# EAGLE design SineWaveGen (EAGLE 6.5.0)
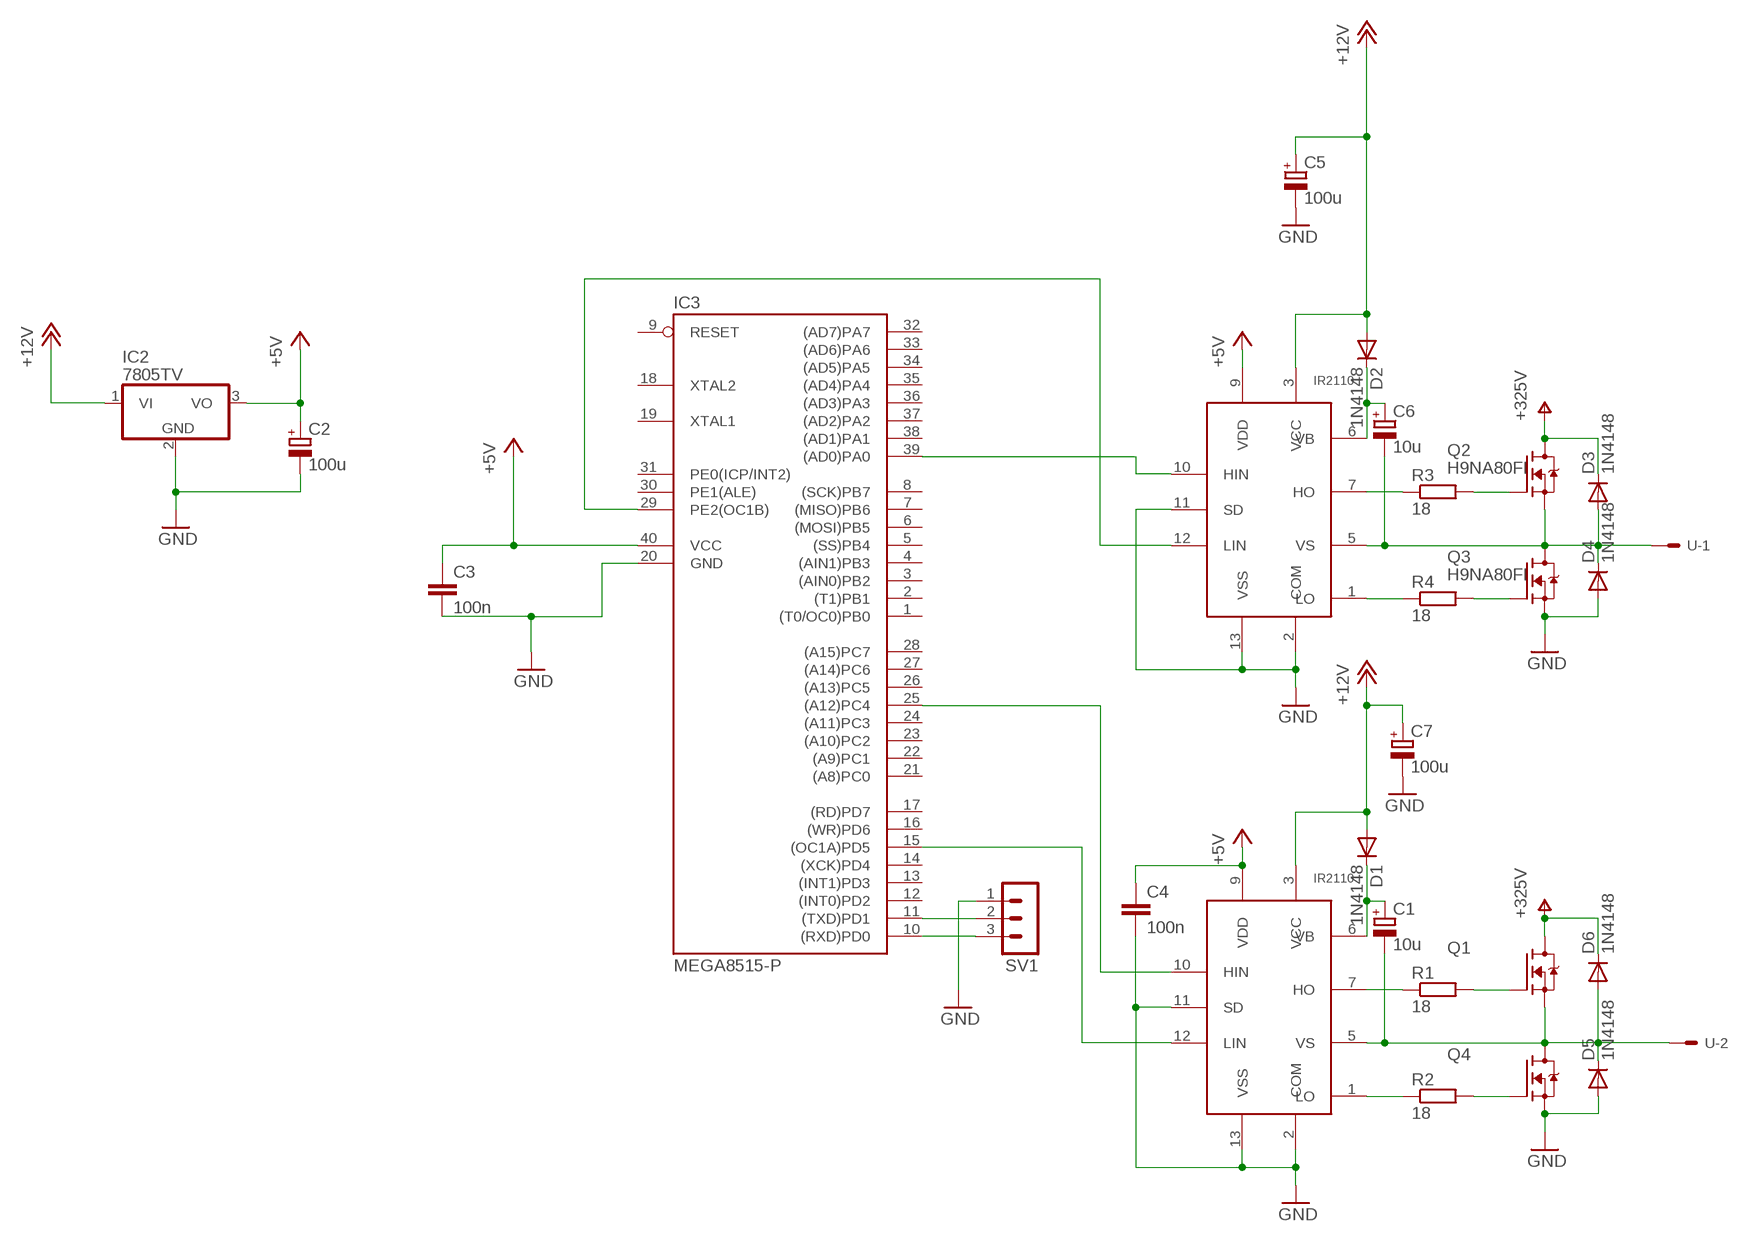
[diagram p0: schematic, sheet 1]

## Parts
C1  10u  CPOL-EUE2.5-7  [E2,5-7]
C2  100u  CPOL-EUE2.5-7  [E2,5-7]
C3  100n  C-EU050-035X075  [C050-035X075]
C4  100n  C-EU050-035X075  [C050-035X075]
C5  100u  CPOL-EUE2.5-7  [E2,5-7]
C6  10u  CPOL-EUE2.5-7  [E2,5-7]
C7  100u  CPOL-EUE2.5-7  [E2,5-7]
D1  1N4148  1N4148DO35-7  [DO35-7]
D2  1N4148  1N4148DO35-7  [DO35-7]
D3  1N4148  1N4148DO35-7  [DO35-7]
D4  1N4148  1N4148DO35-7  [DO35-7]
D5  1N4148  1N4148DO35-7  [DO35-7]
D6  1N4148  1N4148DO35-7  [DO35-7]
IC2  7805TV  [TO220V]
IC3  MEGA8515-P  [DIL40]
Q1  SPW47N60S5  [P-TO247]
Q2  H9NA80FI  SPW47N60S5  [P-TO247]
Q3  H9NA80FI  SPW47N60S5  [P-TO247]
Q4  SPW47N60S5  [P-TO247]
R1  18  R-EU_0207/12  [0207/12]
R2  18  R-EU_0207/12  [0207/12]
R3  18  R-EU_0207/12  [0207/12]
R4  18  R-EU_0207/12  [0207/12]
SV1  MA03-1  [MA03-1]
U  5566-2  [5566-2]
U$1  IR2110  IR2110DIL14  [DIL14]
U$2  IR2110  IR2110DIL14  [DIL14]

## Nets
+5V: C2.+ C3.1 C4.1 IC2.3(VO) IC3.40(VCC) U$1.9(VDD) U$2.9(VDD)
+12V: C5.+ C7.+ D1.A D2.A IC2.1(VI) U$1.3(VCC) U$2.3(VCC)
GND: C2.- C3.2 C4.2 C5.- C7.- D4.A D5.A IC2.2(GND) IC3.20(GND) Q3.3(S) Q4.3(S) SV1.1 U$1.2(COM) U$1.11(SD) U$1.13(VSS) U$2.2(COM) U$2.11(SD) U$2.13(VSS)
N$1: Q1.1(G) R1.2
N$2: IC3.39((AD0)PA0) U$2.10(HIN)
N$3: IC3.15((OC1A)PD5) U$1.12(LIN)
N$4: IC3.25((A12)PC4) U$1.10(HIN)
N$5: R2.1 U$1.1(LO)
N$6: C1.- D5.C D6.A Q1.3(S) Q4.2(D) U$1.5(VS) U.2
N$7: C1.+ D1.C U$1.6(VB)
N$8: Q4.1(G) R2.2
N$9: R1.1 U$1.7(HO)
N$10: IC3.11((TXD)PD1) SV1.2
N$11: IC3.10((RXD)PD0) SV1.3
N$12: IC3.29(PE2(OC1B)) U$2.12(LIN)
N$28: R3.1 U$2.7(HO)
N$29: Q2.1(G) R3.2
N$30: R4.1 U$2.1(LO)
N$31: Q3.1(G) R4.2
N$32: C6.- D3.A D4.C Q2.3(S) Q3.2(D) U$2.5(VS) U.1
N$35: C6.+ D2.C U$2.6(VB)
V+: D3.C D6.C Q1.2(D) Q2.2(D) ; supply symbol labelled +325V
Unconnected: IC3.1((T0/OC0)PB0) IC3.2((T1)PB1) IC3.3((AIN0)PB2) IC3.4((AIN1)PB3) IC3.5((SS)PB4) IC3.6((MOSI)PB5) IC3.7((MISO)PB6) IC3.8((SCK)PB7) IC3.9(RESET) IC3.12((INT0)PD2) IC3.13((INT1)PD3) IC3.14((XCK)PD4) IC3.16((WR)PD6) IC3.17((RD)PD7) IC3.18(XTAL2) IC3.19(XTAL1) IC3.21((A8)PC0) IC3.22((A9)PC1) IC3.23((A10)PC2) IC3.24((A11)PC3) IC3.26((A13)PC5) IC3.27((A14)PC6) IC3.28((A15)PC7) IC3.30(PE1(ALE)) IC3.31(PE0(ICP/INT2)) IC3.32((AD7)PA7) IC3.33((AD6)PA6) IC3.34((AD5)PA5) IC3.35((AD4)PA4) IC3.36((AD3)PA3) IC3.37((AD2)PA2) IC3.38((AD1)PA1)

## Library data of the parts
C1 C2 C5-C7 = rcl:CPOL-EU: POLARIZED CAPACITOR, European symbol
C3 C4 = rcl:C-EU: CAPACITOR, European symbol
D1-D6 = diode:1N4148: DIODE high speed (Philips)
IC2 = linear:78*: Positive VOLTAGE REGULATOR Source: http://cache.national.com/ds/LM/LM78L05.pdf http://www.fairchildsemi.com/ds/LM/LM7805.pdf
IC3 = atmel:MEGA8515-P: MICROCONTROLLER 8 Kbytes FLASH 512 bytes SRAM 512 bytes EEPROM USART 8-channel 10 bit ADC Source: avr.lbr; MPN: ATMEGA8515-16PU; OC_FARNELL: 9171401; OC_NEWARK: 01M6905
Q1-Q4 = transistor-fet:SPW47N60S5: Cool MOS Power Transistor
R1-R4 = rcl:R-EU_: RESISTOR, European symbol
SV1 = con-lstb:MA03-1: PIN HEADER; OC_FARNELL: unknown; OC_NEWARK: unknown
U = con-molex:5566-2: Mini FIT connector 2 pol Source: http://www.molex.com
U$1 U$2 = BLDC:IR2110: Halfbridge Driver

## Board
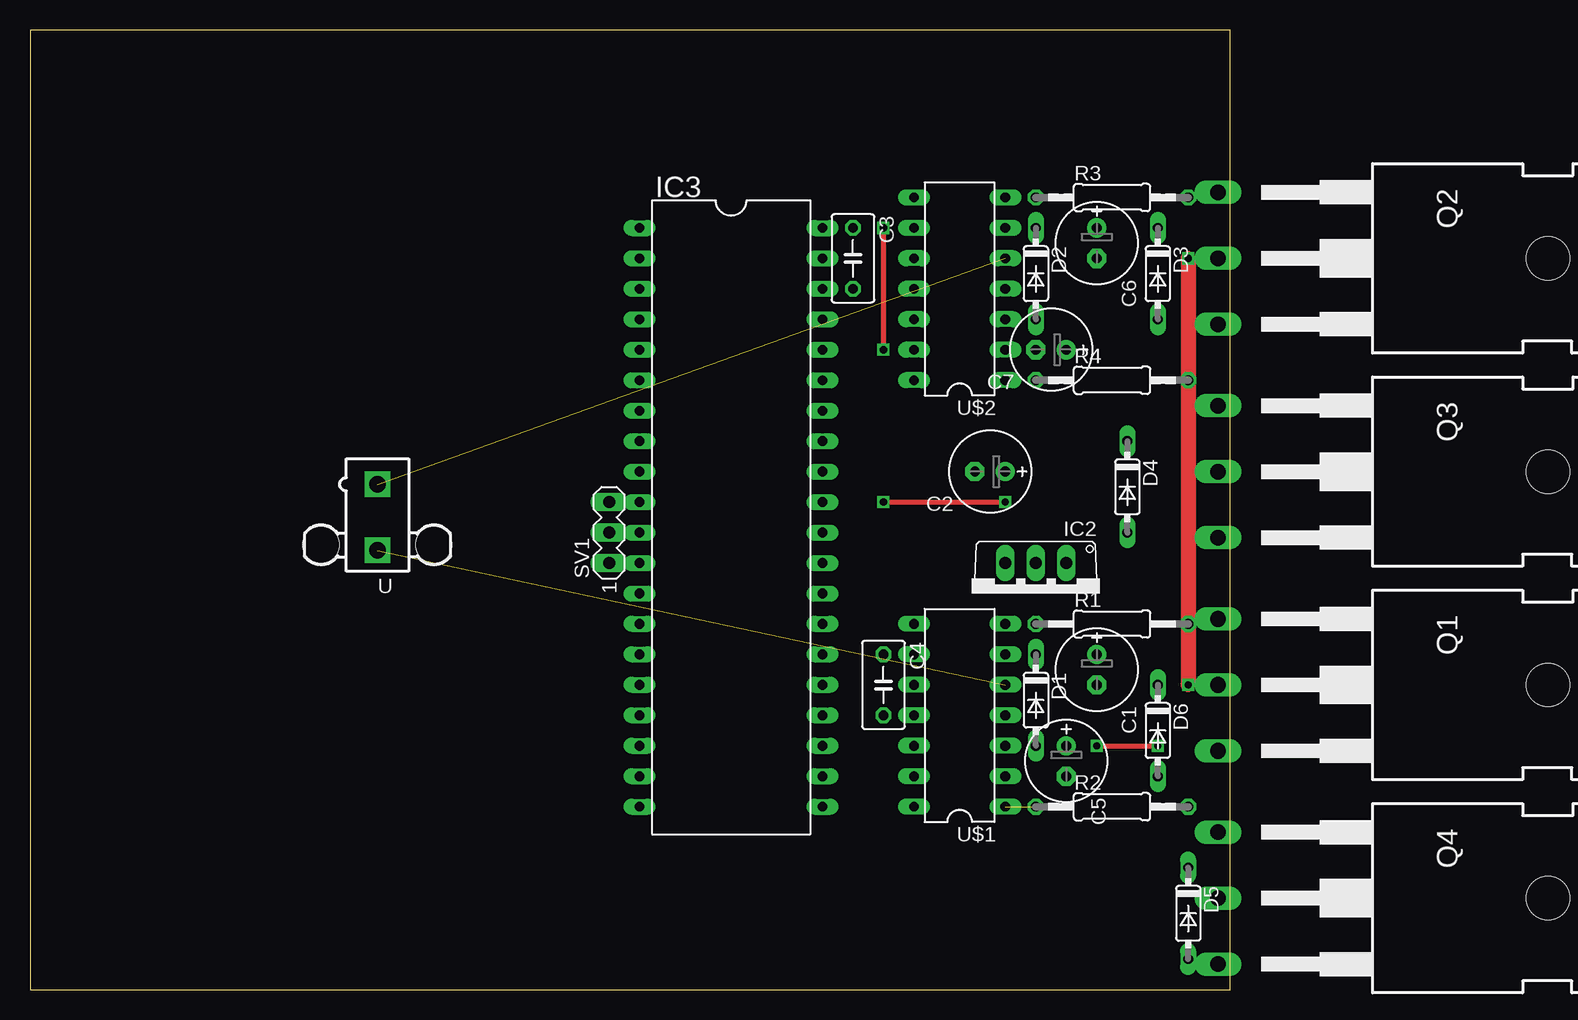
[diagram p1: board, top side]
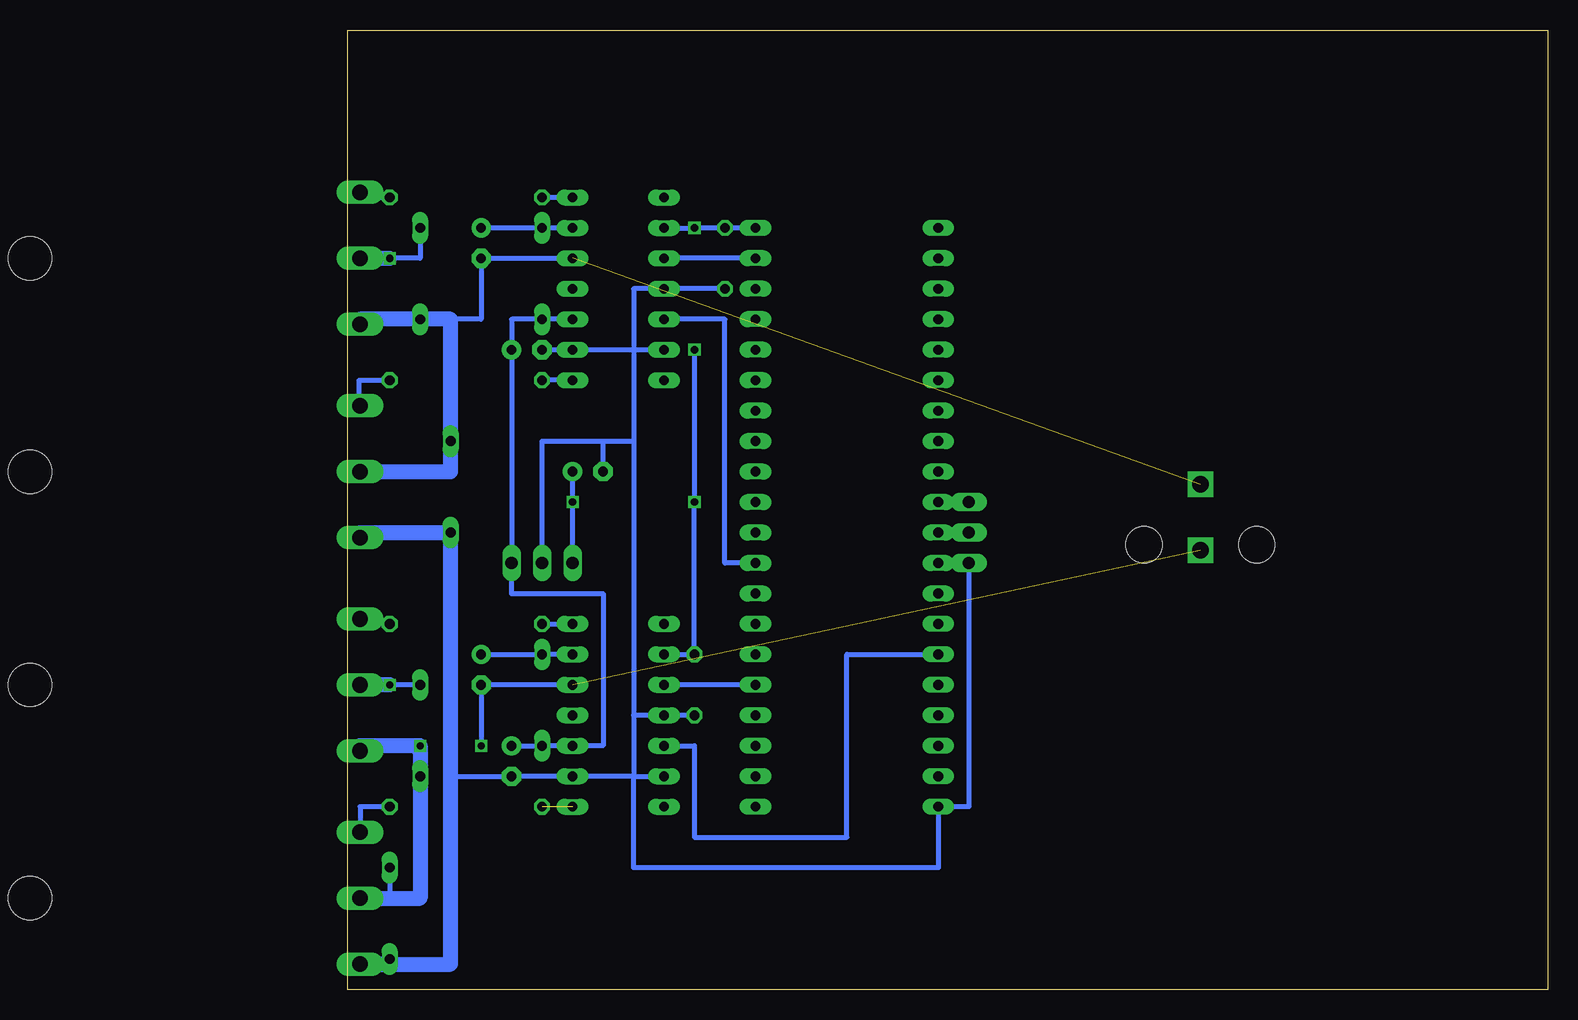
[diagram p2: board, bottom side, seen from below]

Size 100 x 80 mm. Coordinates in mm from the lower left corner, seen from the top.
Outline: 0,0 100,0 100,80 0,80 0,0
Copper layers (1*16): Top 0.035mm / dielectric 1.5mm / Bottom 0.035mm
Design rules "default": minimum track width 10mil, minimum drill 24mil, track to track 8mil, track to pad 8mil, pad to pad 8mil, via to via 8mil, smd to smd 8mil, copper to edge 40mil, drill to drill 8mil, minimum pad ring 10mil, minimum via ring 8mil, stop-mask expansion 4mil, vias tented up to drill 0mil, thermal gap 10mil

### Footprints (pad centres in the part's own frame; a part is rotated, then mirrored left to right if it is on the bottom)
E2,5-7 = drill 0.813 pad 1.6: + -1.27,0 | drill 0.813 pad 1.6 octagon: - 1.27,0
C050-035X075 = drill 0.813 octagon: 1 -2.54,0; 2 2.54,0
DO35-7 = drill 0.813 long: A 3.81,0; C -3.81,0
TO220V = drill 1.016 long: 1 -2.54,-2.54; 2 0,-2.54; 3 2.54,-2.54
DIL40 = drill 0.813 long: 1 -24.13,-7.62; 2 -21.59,-7.62; 3 -19.05,-7.62; 4 -16.51,-7.62; 5 -13.97,-7.62; 6 -11.43,-7.62; 7 -8.89,-7.62; 8 -6.35,-7.62; 9 -3.81,-7.62; 10 -1.27,-7.62; 11 1.27,-7.62; 12 3.81,-7.62; 13 6.35,-7.62; 14 8.89,-7.62; 15 11.43,-7.62; 16 13.97,-7.62; 17 16.51,-7.62; 18 19.05,-7.62; 19 21.59,-7.62; 20 24.13,-7.62; 21 24.13,7.62; 22 21.59,7.62; 23 19.05,7.62; 24 16.51,7.62; 25 13.97,7.62; 26 11.43,7.62; 27 8.89,7.62; 28 6.35,7.62; 29 3.81,7.62; 30 1.27,7.62; 31 -1.27,7.62; 32 -3.81,7.62; 33 -6.35,7.62; 34 -8.89,7.62; 35 -11.43,7.62; 36 -13.97,7.62; 37 -16.51,7.62; 38 -19.05,7.62; 39 -21.59,7.62; 40 -24.13,7.62
P-TO247 = drill 1.3 long: 1 -5.5,-27.5; 2 0,-27.5; 3 5.5,-27.5 | hole 3.6: 0,0
0207/12 = drill 0.813 octagon: 1 -6.35,0; 2 6.35,0
MA03-1 = drill 1.016 long: 1 -2.54,0; 2 0,0; 3 2.54,0
5566-2 = drill 1.4 square: 1 0,-2.75; 2 0,2.75 | hole 3: 4.7,2.29; -4.7,2.29
DIL14 = drill 0.813 long: 1 -7.62,-3.81; 2 -5.08,-3.81; 3 -2.54,-3.81; 4 0,-3.81; 5 2.54,-3.81; 6 5.08,-3.81; 7 7.62,-3.81; 8 7.62,3.81; 9 5.08,3.81; 10 2.54,3.81; 11 0,3.81; 12 -2.54,3.81; 13 -5.08,3.81; 14 -7.62,3.81

### Placement (x,y rotation side)
C1  88.9,26.67 270 top
C2  80.01,43.18 180 top
C3  68.58,60.96 270 top
C4  71.12,25.4 270 top
C5  86.36,19.05 270 top
C6  88.9,62.23 270 top
C7  85.09,53.34 180 top
D1  83.82,24.13 270 top
D2  83.82,59.69 270 top
D3  93.98,59.69 270 top
D4  91.44,41.91 270 top
D5  96.52,6.35 270 top
D6  93.98,21.59 270 top
IC2  83.82,33.02 180 top
IC3  58.42,39.37 270 top
Q1  126.49,25.4 270 top
Q2  126.49,60.96 270 top
Q3  126.49,43.18 270 top
Q4  126.49,7.62 270 top
R1  90.17,30.48 0 top
R2  90.17,15.24 0 top
R3  90.17,66.04 0 top
R4  90.17,50.8 0 top
SV1  48.26,38.1 90 top
U  28.96,39.37 180 top
U$1  77.47,22.86 90 top
U$2  77.47,58.42 90 top

### Tracks (layer width: path | path; a pad name or v marks a point on that pad's centre or on a via)
+5V  (via drill 0.6)
  Top 0.406: v71.12,63.5 v71.12,53.34 | v71.12,40.64 v81.28,40.64
  Bottom 0.406: IC2.3 v81.28,40.64 C2.+ | U$2.9 v71.12,63.5 C3.1 IC3.40 | v71.12,53.34 v71.12,40.64 C4.1 U$1.9
+12V
  Bottom 0.406: U$2.3 D2.A 86.36,55.88 C7.+ IC2.1 86.36,33.02 78.74,33.02 78.74,20.32 U$1.3 D1.A C5.+
GND
  Bottom 0.406: 76.2,53.34 U$2.2 C7.- | 76.2,22.86 76.2,17.78 | 76.2,17.78 U$1.13 | 76.2,22.86 U$1.11 C4.2 | 76.2,53.34 U$2.13 | 76.2,53.34 76.2,58.42 U$2.11 C3.2 | IC2.2 83.82,45.72 78.74,45.72 | 76.2,53.34 76.2,45.72 | 76.2,45.72 76.2,22.86 | 76.2,17.78 76.2,10.16 50.8,10.16 IC3.20 48.26,15.24 SV1.1 | 78.74,45.72 76.2,45.72 | C2.- 78.74,45.72 | 76.2,17.78 U$1.2 C5.- 91.44,17.78 D4.A | D5.A 98.99,2.54 Q4.3
  Bottom 1.27: Q3.3 98.99,38.1 D4.A 91.44,2.12 Q4.3
N$1
  Bottom 0.406: R1.2 98.99,30.48 Q1.1
N$2
  Bottom 0.406: IC3.39 U$2.10
N$3
  Bottom 0.406: U$1.12 71.12,20.32 71.12,12.7 58.42,12.7 58.42,27.94 IC3.15
N$4
  Bottom 0.406: IC3.25 U$1.10
N$5  (1 unrouted)
N$6  (via drill 0.6)  (1 unrouted)
  Top 0.406: v88.9,20.32 v93.98,20.32
  Bottom 0.406: U$1.5 C1.- v88.9,20.32 | D5.C 96.52,7.62
  Bottom 1.27: Q4.2 96.52,7.62 93.98,7.62 D6.A 93.98,19.81 v93.98,20.32 98.99,20.32 Q1.3
N$7
  Bottom 0.406: U$1.6 D1.C C1.+
N$8
  Bottom 0.406: R2.2 98.99,15.24 Q4.1
N$9
  Bottom 0.406: R1.1 U$1.7
N$10
  Bottom 0.406: IC3.11 SV1.2
N$11
  Bottom 0.406: SV1.3 IC3.10
N$12
  Bottom 0.406: IC3.29 68.58,35.56 68.58,55.88 U$2.12
N$28
  Bottom 0.406: U$2.7 R3.1
N$29
  Bottom 0.406: R3.2 98.99,66.04 Q2.1
N$30
  Bottom 0.406: U$2.1 R4.1
N$31
  Bottom 0.406: Q3.1 99.06,48.68 99.06,50.8 R4.2
N$32  (1 unrouted)
  Bottom 0.406: U$2.5 C6.- 88.9,55.88 D3.A
  Bottom 1.27: Q3.2 91.44,43.18 D4.C 91.44,55.88 D3.A 98.99,55.88 Q2.3
N$35
  Bottom 0.406: D2.C U$2.6 C6.+
V+  (via drill 0.6)
  Top 1.27: v96.52,60.96 v96.52,25.4
  Bottom 0.406: D3.C 93.98,60.96 v96.52,60.96 | D6.C v96.52,25.4
  Bottom 1.27: Q2.2 v96.52,60.96 | v96.52,25.4 Q1.2